# Altium schematic sheet MCU.SchDoc
size 297 x 209 mm; Address1: Address1; Address2: Address2; Address3: Address3; Address4: Address4; SheetNumber: 1; Scale: 1:1; Обозначение документа: АБВГ.123456.001Э3
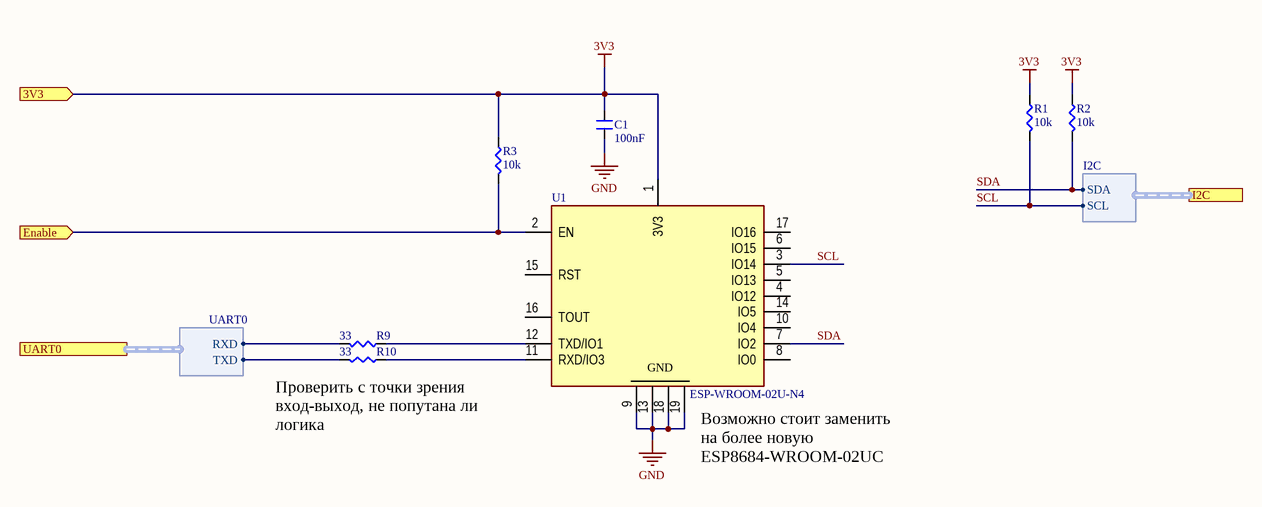
[diagram p0: MCU.SchDoc]

## Parts
C1  100nF  [CAP0603]
R1  10k  [RES0603]
R2  10k  [RES0603]
R3  10k  [RES0603]
R9  33  [RES0603]
R10  33  [RES0603]
U1  ESP-WROOM-02U-N4  [ESP-WROOM-02U-N4]

## Ports
3V3 (in), Enable (in), I2C (harness I2C), UART0 (harness UART0)

## Harnesses
I2C: SDA, SCL
UART0: TXD, RXD

## Nets
3V3: C1.2 R1.2 R2.2 R3.2 U1.1(3V3) ; port 3V3
GND: C1.1 U1.9(GND) U1.13(GND) U1.18(GND) U1.19(GND)
Enable: R3.1 U1.2(EN) ; port Enable
SCL: R1.1 U1.3(IO14) ; port I2C.SCL
SDA: R2.1 U1.7(IO2) ; port I2C.SDA
NetR9_1: R9.1 ; port UART0.RXD
NetR9_2: R9.2 U1.12(TXD/IO1)
NetR10_1: R10.1 ; port UART0.TXD
NetR10_2: R10.2 U1.11(RXD/IO3)

Not connected (* = marked no-connect by the designer): U1 4(IO12) 5(IO13) 6(IO15) 8(IO0) 10(IO4) 14(IO5) 15(RST) 16(TOUT) 17(IO16)

## Notes on the sheet
- (near R10) Проверить с точки зрения вход-выход, не попутана ли логика
- (near U1) Возможно стоит заменить на более новую ESP8684-WROOM-02UC
- Подп. и дата
- Инв. № дубл.
- Взам. инв. №
- Инв. № подл.
- Изм.
- Лист
- № докум.
- Подп.
- Дата
- Копировал
- Формат А4

## Library data of the parts
C1 = GCM188R71H104KA57J: Tolerance ±10% / Rated Voltage 50Vdc / Temperature 0±30ppm/℃; Manufacturer: Arrow Electronics; Item: 100nF 50V  ±10%; Vdc: 50V; Part Number: GCM188R71H104KA57J; Supplier 1: Mouser; Supplier Part Number 1: 81-GCM188R71H104KA7J; Case: 0603; Tolerance: 10%; Value: 100nF; HelpURL: http://www.farnell.com/datasheets/4360.pdf?src-supplier=Element14; Category: Multilayer Ceramic Capacitors - SMD/SMT
R1-R3 = CR0603-FX-1002ELF: Tolerance ±1% / Power (Watts) 0.1W, 1/10W / Temperature Coefficient ±100ppm/°C; Manufacturer: Bourns; Item: 10k  ±1% 0.1W; Part Number: CR0603-FX-1002ELF; Supplier 1: Mouser; Supplier Part Number 1: 652-CR0603FX-1002ELF; Case: 0603; Tolerance: 1%; Value: 10k; HelpURL: https://eu.mouser.com/datasheet/2/54/cr-1858361.pdf; Category: Thin Film Resistors - SMD
R9 R10 = CR0603FX-33R0ELF: Tolerance ±1% / Power (Watts) 0.1W, 1/10W / Temperature Coefficient ±100ppm/°C; Manufacturer: Bourns; Item: 33  ±1% 0.1W; Part Number: CR0603FX-33R0ELF; Supplier 1: Mouser; Supplier Part Number 1: 652-CR0603FX-33R0ELF; Case: 0603; Tolerance: 1%; Value: 33; HelpURL: https://eu.mouser.com/datasheet/2/54/crxxxxx-1858361.pdf; Category: Thin Film Resistors - SMD
U1 = ESP-WROOM-02U-N4: ESP-WROOM-02U-N4, WiFi Modules - 802.11 SMD Module, ESP8266EX, 32Mbits SPI flash, UART Mode, U.FL antenna connector; Manufacturer: Espressif Systems; Interfaces: GPIO, HSPI, I2C, I2S. IR, PWM, UART; Vdss: 3.3V; Part Number: ESP-WROOM-02U-N4; Item: ESP-WROOM-02U-N4; Supplier 1: Chipdip; Supplier Part Number 1: 8004788563; HelpURL: https://www.espressif.com/sites/default/files/documentation/esp-wroom-02u_esp-wroom-02d_datasheet_en.pdf; Category: WiFi Modules - 802.11